# Altium schematic sheet High Current H-Bridge.SchDoc: Title
size A4; Date: Date; CheckedBy: Checked By; SheetNumber: x; SheetTotal: y; DesignedBy: Designed By
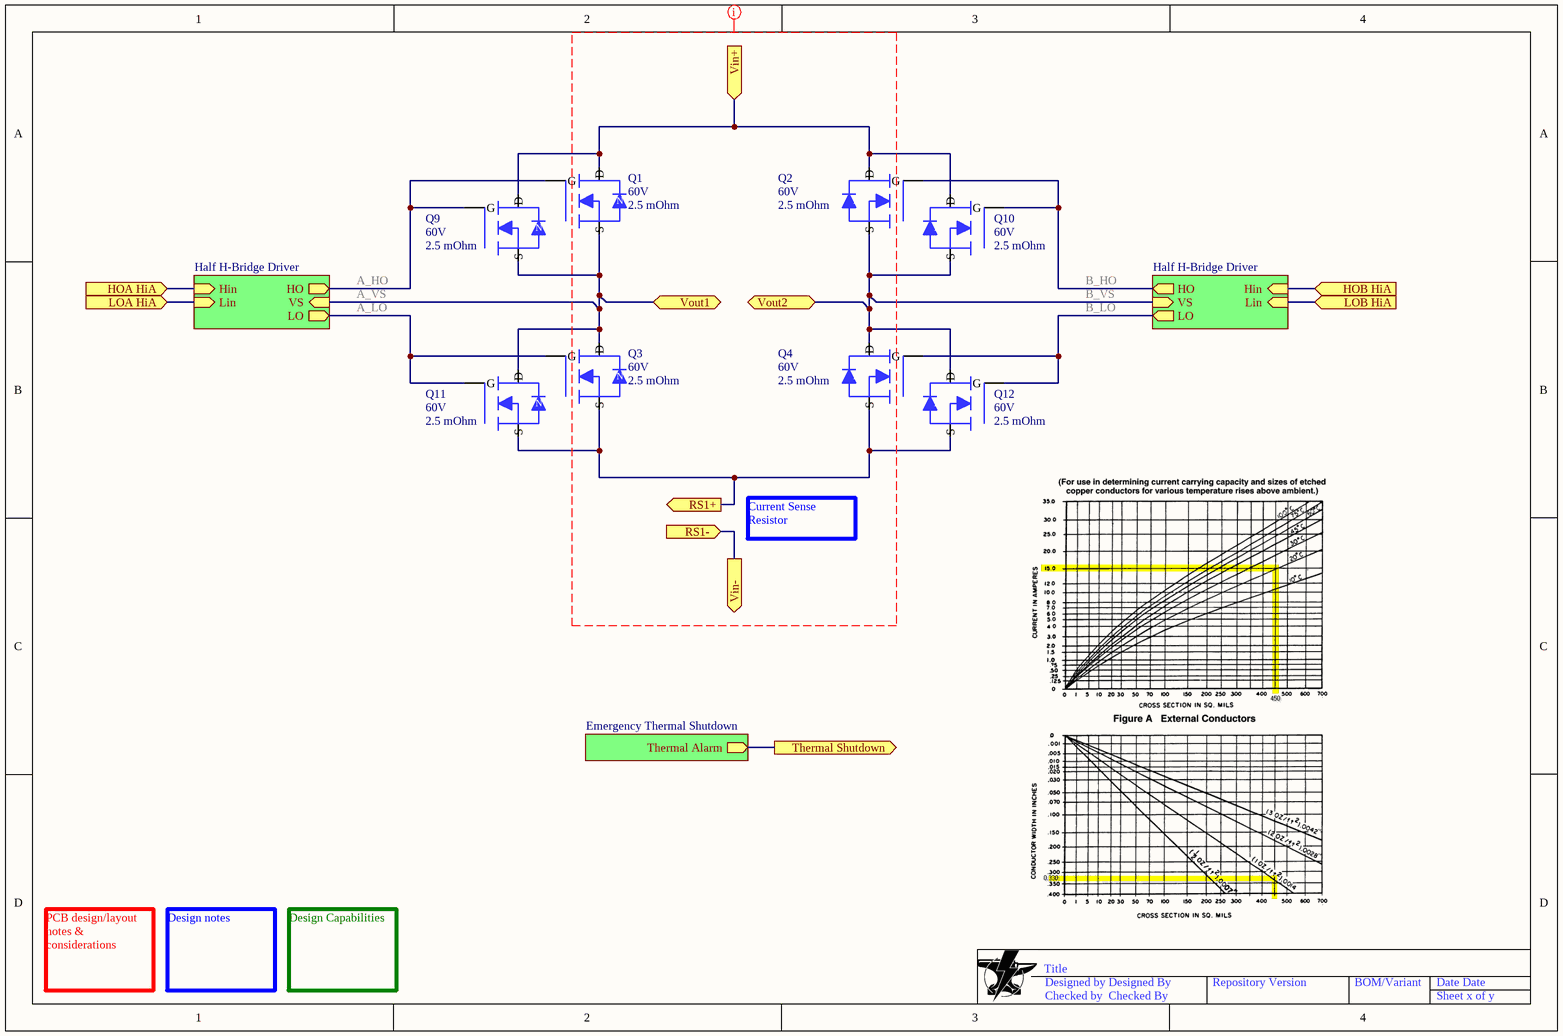
[diagram p0: High Current H-Bridge.SchDoc]

## Parts
Q1  Drain to Source Voltage (Vdss): 60V  Rds On (Max) @ Id, Vgs: 2.5 mOhm  [DPAK]  (hidden comment: N-MOSFET)
Q2  Drain to Source Voltage (Vdss): 60V  Rds On (Max) @ Id, Vgs: 2.5 mOhm  [DPAK]  (hidden comment: N-MOSFET)
Q3  Drain to Source Voltage (Vdss): 60V  Rds On (Max) @ Id, Vgs: 2.5 mOhm  [DPAK]  (hidden comment: N-MOSFET)
Q4  Drain to Source Voltage (Vdss): 60V  Rds On (Max) @ Id, Vgs: 2.5 mOhm  [DPAK]  (hidden comment: N-MOSFET)
Q9  Drain to Source Voltage (Vdss): 60V  Rds On (Max) @ Id, Vgs: 2.5 mOhm  [DPAK]  (hidden comment: N-MOSFET)
Q10  Drain to Source Voltage (Vdss): 60V  Rds On (Max) @ Id, Vgs: 2.5 mOhm  [DPAK]  (hidden comment: N-MOSFET)
Q11  Drain to Source Voltage (Vdss): 60V  Rds On (Max) @ Id, Vgs: 2.5 mOhm  [DPAK]  (hidden comment: N-MOSFET)
Q12  Drain to Source Voltage (Vdss): 60V  Rds On (Max) @ Id, Vgs: 2.5 mOhm  [DPAK]  (hidden comment: N-MOSFET)

## Sub-sheets
Emergency Thermal Shutdown = Emergency Thermal Shutdown.SchDoc: Thermal Alarm (out)
Half H-Bridge Driver = Half H-Bridge Driver.SchDoc: HO (out), VS (in), LO (out), Hin (in), Lin (in)
Half H-Bridge Driver = Half H-Bridge Driver.SchDoc: HO (out), VS (in), LO (out), Hin (in), Lin (in)

## Ports
HOA HiA (in), HOB HiA (in), LOA HiA (in), LOB HiA (in), RS1+ (out), RS1- (in), Thermal Shutdown (out), Vin+ (in), Vin- (out), Vout1 (bidir), Vout2 (bidir)

## Nets
A_HO: Q1.1(G) Q9.1(G) ; sheet Half H-Bridge Driver/HO
A_LO: Q3.1(G) Q11.1(G) ; sheet Half H-Bridge Driver/LO
A_VS: Q1.3(S) Q3.2(D) Q9.3(S) Q11.2(D) ; port Vout1, sheet Half H-Bridge Driver/VS
B_HO: Q2.1(G) Q10.1(G) ; sheet Half H-Bridge Driver/HO
B_LO: Q4.1(G) Q12.1(G) ; sheet Half H-Bridge Driver/LO
B_VS: Q2.3(S) Q4.2(D) Q10.3(S) Q12.2(D) ; port Vout2, sheet Half H-Bridge Driver/VS
HOA HiA: port HOA HiA, sheet Half H-Bridge Driver/Hin
HOB HiA: port HOB HiA, sheet Half H-Bridge Driver/Hin
LOA HiA: port LOA HiA, sheet Half H-Bridge Driver/Lin
LOB HiA: port LOB HiA, sheet Half H-Bridge Driver/Lin
RS1+: Q3.3(S) Q4.3(S) Q11.3(S) Q12.3(S) ; port RS1+
RS1-: port Vin-, port RS1-
Thermal Shutdown: port Thermal Shutdown, sheet Emergency Thermal Shutdown/Thermal Alarm
Vin+: Q1.2(D) Q2.2(D) Q9.2(D) Q10.2(D) ; port Vin+

## Layout directives
net class 15A: (no net found under the mark)

## Notes on the sheet
- Current Sense Resistor
- PCB design/layout notes & considerations
- Design notes
- Design Capabilities
- Repository Version
- BOM/Variant
- (in symbol N-MOSFET 2.5mR 60V) N

## Library data of the parts
Q1-Q4 Q9-Q12 = N-MOSFET 2.5mR 60V: Manufacturer: Infineon Technologies; Manufacturer Part Number: IPD025N06N; FET Type: N-Channel; Current - Continuous Drain (Id) @ 25°C: 90A; Drive Voltage (Max Rds On,  Min Rds On): 6V, 10V; Vgs(th) (Max) @ Id: 2.8V @ 95µA; Gate Charge (Qg) (Max) @ Vgs: 71nC @ 10V; Input Capacitance (Ciss) (Max) @ Vds: 5200pF @ 30V; Vgs (Max): ±20V; Power Dissipation (Max): 3W (Ta), 167W (Tc); Supplier 1: Digi-Key; Supplier Part Number 1: IPD025N06NCT-ND; RoHS: RoHS Compliant; Category: Discrete Semiconductor Products; Stock 1: 5405; Pricing 1: 1=1.91, 10=1.72, 100=1.3822, 500=1.13558, 1000=0.94091 (USD); Packaging: Cut Tape (CT); Part Status: Active; Technology: MOSFET (Metal Oxide); FET Feature: -; Operating Temperature: -55°C ~ 175°C (TJ); Mounting Type: Surface Mount; Supplier Device Package: PG-TO252-3; Package / Case: TO-252-3, DPak (2 Leads + Tab), SC-63; ComponentLink1URL: http://www.infineon.com/dgdl/IPD025N06N_Rev2+1.pdf?folderId=db3a304313b8b5a60113cee8763b02d7&fileId=db3a304336415dec0136531648062c76; ComponentLink1Description: Spec Sheet; Value: N-MOSFET 2.5mR